# Altium project 10W_Class_D_Amp.PrjPcb
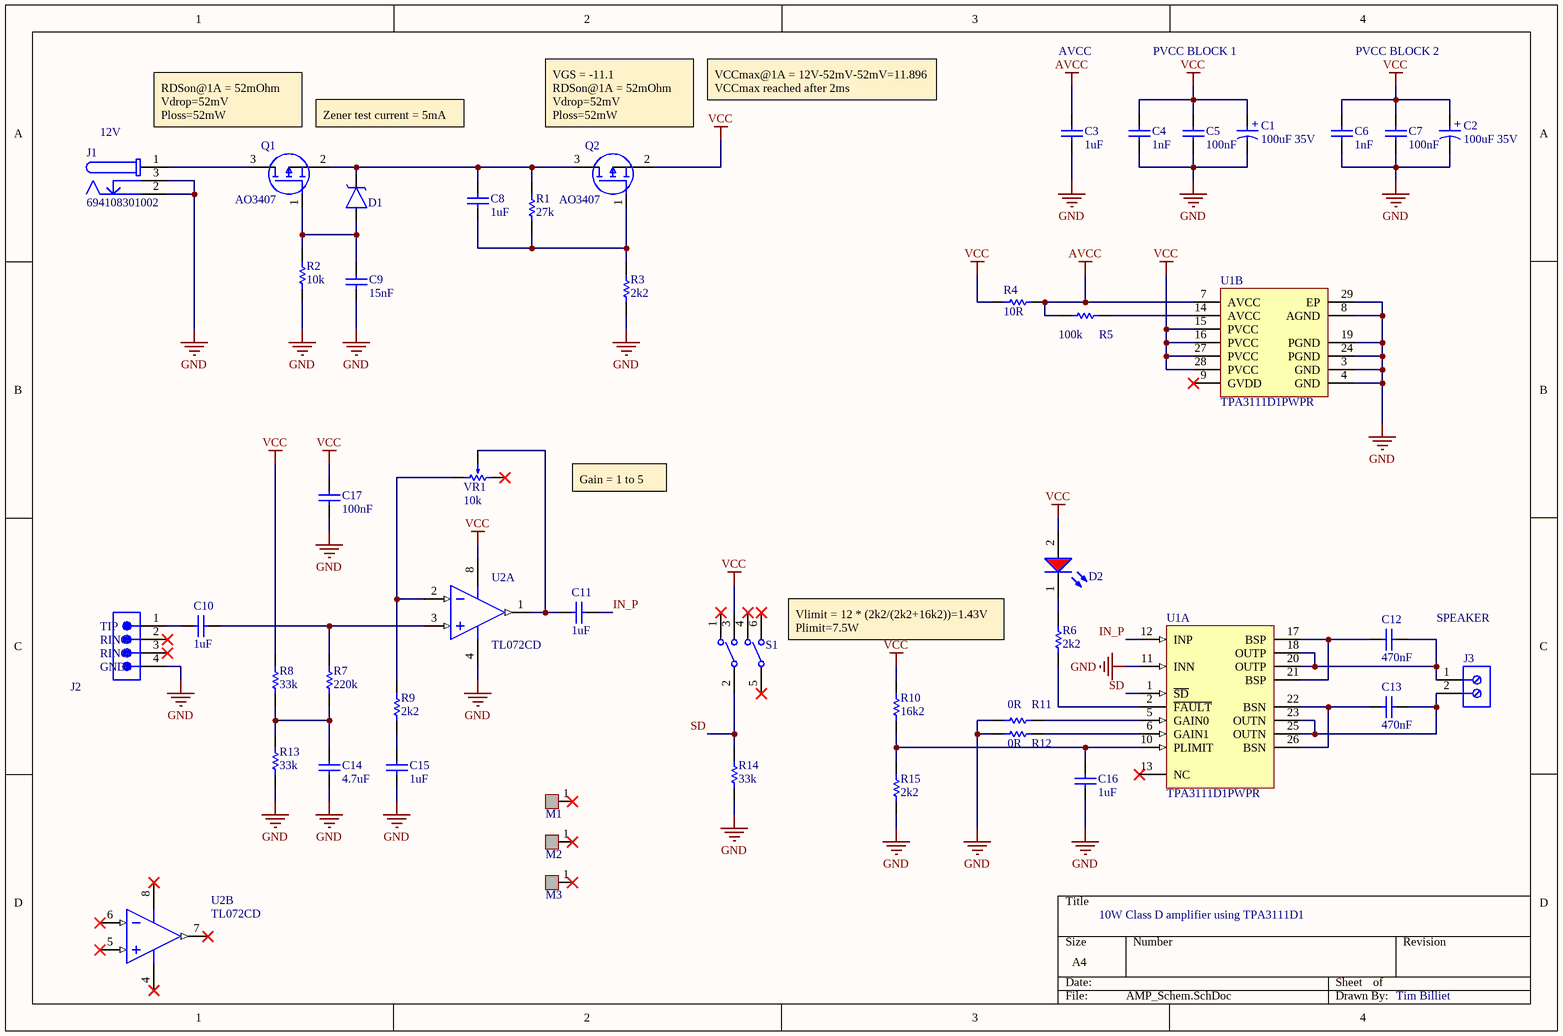
[diagram p0: AMP_Schem.SchDoc]
1 sheet, 46 parts. Net scope: global (net labels, ports and power ports of the same name join across sheets).
Board file: AMP_PCB.PcbDoc

## Sheet AMP_Schem.SchDoc
size A4; SheetNumber: 1; SheetTotal: 1; SPICEModelCacheFDDZXNEK: <root> / <DocumentId>FDDZXNEK</DocumentId> / <CacheFrame Number="0"> / <Model Name="tologic_0" Kind="CKT"> / <Text>.SUBCKT TOLOGIC_0  VI VO / ESLICE VO 0 VALUE = {IF(V(VI)&gt;2,1,0)} / RSLICE VO 0 1G / .ENDS TOLOGIC_0</Text> / </Model> / <Model Name="prheo_0" Kind="CKT"> / <Text>.SUBCKT PRHEO_0  G0 G1 VP VN  PARAMS: R1 = 9K R2 = 6K R3 = 15K R4 = 30K / ES1  VS1  0  VALUE  =  { IF(V(G0) &gt; 0.5,IF(V(G1) &gt; 0.5,1,0),0) } / ES2  VS2  0  VALUE  =  { IF(V(G0) &lt; 0.5,IF(V(G1) &gt; 0.5,1,0),0) } / ES3  VS3  0  VALUE  =  { IF(V(G0) &gt; 0.5,IF(V(G1) &lt; 0.5,1,0),0) } / ES4  VS4  0  VALUE  =  { IF(V(G0) &lt; 0.5,IF(V(G1) &lt; 0.5,1,0),0) } / ERES  VP  2   VALUE  =  { I(VSEI)*(V(VS2)*R2 + V(VS3)*(R3+R2) + V(VS4)*(R4+R3+R2)) } / VSEI  2   3  DC 0V / RSEI  3  VN  {R1} / .ENDS PRHEO_0</Text> / </Model> / <Model Name="comp" Kind="CKT"> / <Text>.SUBCKT COMP VDD VP VN VO VSS / ECOMP  VO  0  VALUE = { LIMIT(V(VP,VN)*1E5,V(VDD),V(VSS)) } / .ENDS COMP</Text> / </Model> / <Model Name="bd_comp_0" Kind="CKT"> / <Text>.SUBCKT BD_COMP_0  VDD VIP VIN REF VOP VON VSS / XCP  VDD  VIP  REF  VOP  VSS  COMP / XCN  VDD  VIN  REF  VON  VSS  COMP / .ENDS BD_COMP_0</Text> / <Dependency>0\comp</Dependency> / </Model> / <Model Name="plimit_0" Kind="CKT"> / <Text>.SUBCKT PLIMIT_0  PVCC VPLIMIT VSUPP / ELIMIT  PVCC  VSUPP  VALUE = { IF(V(PVCC)&gt;4*V(VPLIMIT),V(PVCC) - 4*V(VPLIMIT),0) } / .ENDS PLIMIT_0</Text> / </Model> / <Model Name="std_opa_0" Kind="CKT"> / <Text>.SUBCKT STD_OPA_0  VDD VIP VIN VOP VON VSS / EIP  FP1  VCM  VIP  VIN  200E3 / EIN  VCM  FP2  VIP  VIN  200E3 / RP1  FP1  VIBP  5.0E+6 / CP1  VIBP 0  3.18E-10 / RP2  FP2  VIBN  5.0E+6 / CP2  VIBN 0 3.18E-10 / EVCM VCM 0 VALUE = {(V(VDD,0)+V(VSS,0))*0.5} / EBP  VOP  0  VALUE = {LIMIT(V(VIBP),V(VDD) - 0.1,V(VSS) + 0.1)} / EBN  VON  0  VALUE = {LIMIT(V(VIBN),V(VDD) - 0.1,V(VSS) + 0.1)} / .ENDS STD_OPA_0</Text> / </Model> / <Model Name="delay_line" Kind="CKT"> / <Text>.SUBCKT DELAY_LINE VI VO / E1 VIX 0 VI 0 1 / T1 VIX 0 VOX 0 Z0 = 75 TD = 25NS / RL VOX 0 75 / E2 VO 0 VOX 0 1 / .ENDS DELAY_LINE</Text> / </Model> / <Model Name="and" Kind="CKT"> / <Text>.SUBCKT AND VDD A B Y VSS / EA  VA  0  VALUE = {IF(V(A)&gt;V(VCM),1,0)} / EB  VB  0  VALUE = {IF(V(B)&gt;V(VCM),1,0)} / ECM  VCM  0  VALUE = {(V(VDD,0)+V(VSS,0))*0.5} / EY  Y  0  VALUE = {IF(V(VA)*V(VB)&gt;0.5,V(VDD),V(VSS))} / .ENDS AND</Text> / </Model> / <Model Name="not" Kind="CKT"> / <Text>.SUBCKT NOT VDD VI VO VSS / ESLICE VO 0  VALUE = {IF(V(VI)&gt;V(VCM),V(VSS),V(VDD))} / ECM  VCM  0  VALUE = {(V(VDD,0)+V(VSS,0))*0.5} / .ENDS NOT</Text> / </Model> / <Model Name="hdriver_0" Kind="CKT"> / <Text>.SUBCKT HDRIVER_0  VDD VIA VIB VSS VHA VLA VHB VLB / X0  VIA  VXA  DELAY_LINE / X1  VDD  VIA  VXA  VHA  VSS AND / X2  VDD  VIA  VNA  VSS  NOT / X3  VNA  VYA  DELAY_LINE / X4  VDD  VNA  VYA  VLA  VSS AND / X5  VIB  VXB  DELAY_LINE / X6  VDD  VIB  VXB  VHB  VSS AND / X7  VDD  VIB  VNB  VSS  NOT / X8  VNB  VYB  DELAY_LINE / X9  VDD  VNB  VYB  VLB  VSS AND / .ENDS HDRIVER_0</Text> / <Dependency>0\delay_line</Dependency> / <Dependency>0\and</Dependency> / <Dependency>0\not</Dependency> / </Model> / <Model Name="hbridge_0" Kind="CKT"> / <Text>.SUBCKT HBRIDGE_0  AVDD PVDD VHA VLA VHB VLB VOA VOB SDB SSS VSS / ESD  VSDBX  0  VALUE = {IF(V(SDB)&gt;1.3,1,0)} / ESS  VSSSX  0  VALUE = {IF(V(SSS)&gt;1.3,1,0)} / EBETA  VBETA  0  POLY(1) (AVDD,0) 0 100 / *                            VDS       VG      VBETA     SHUTDOWN   SPECIAL / GAH  PVDD  VOA  VALUE = { V(PVDD,VOA)*V(VHA,0)*V(VBETA,0)*V(VSDBX,0)*V(VSSSX,0) } / RAH  PVDD  VOA  2E3 / DAH  VOA  PVDD  IDEAL_DIODE / GAL  VOA  VSS  VALUE = { V(VOA,VSS)*(V(VLA,0)*V(VSSSX,0) + V(AVDD,0)*(1 - V(VSSSX,0)))*V(VBETA,0)*V(VSDBX,0) } / RAL  VOA  VSS  2E3 / DAL  VSS  VOA  IDEAL_DIODE / GBH  PVDD  VOB  VALUE = { V(PVDD,VOB)*V(VHB,0)*V(VBETA,0)*V(VSDBX,0)*V(VSSSX,0) } / RBH  PVDD  VOB  2E3 / DBH  VOB  PVDD  IDEAL_DIODE / GBL  VOB  VSS  VALUE = { V(VOB,VSS)*(V(VLB,0)*V(VSSSX,0) + V(AVDD,0)*(1 - V(VSSSX,0)))*V(VBETA,0)*V(VSDBX,0) } / RBL  VOB  VSS  2E3 / DBL  VSS  VOB  IDEAL_DIODE / .MODEL IDEAL_DIODE D ( N = 0.01 ) / .ENDS HBRIDGE_0</Text> / </Model> / <Model Name="tpa3110d2_half_0" Kind="CKT"> / <Text>.SUBCKT TPA3110D2_HALF_0 GAIN0 INN INP AGND VREF GAIN1 AVCC PGND OUTN SD PLIMIT / + PVCC OUTP / XU4         G0 G1 INN 24 PRHEO_0 / XU6         G0 G1 INP 35 PRHEO_0 / XU3         PVCC PLIMIT PLIM PLIMIT_0 / C10         25 26 5P / C9          27 28 5P / C8          26 29 25P / C5          28 30 25P / XU11        AVCC 28 26 29 30 AGND STD_OPA_0 / R2          25 26 110K / R1          27 28 110K / XU10        AVCC PLIM 31 32 34 33 OUTP OUTN SD AVCC PGND HBRIDGE_0 / XU12        AVCC 36 37 AGND 31 32 34 33 HDRIVER_0 / R4          35 OUTN 600K / R3          24 OUTP 600K / C7          24 27 8.84P / C6          35 25 8.84P / XU1         AVCC 35 24 27 25 AGND STD_OPA_0 / XU8         AVCC 29 30 VREF 36 37 AGND BD_COMP_0 / XU5         GAIN0 G0 TOLOGIC_0 / XU2         GAIN1 G1 TOLOGIC_0 / .ENDS</Text> / <Dependency>0\tologic_0</Dependency> / <Dependency>0\prheo_0</Dependency> / <Dependency>0\bd_comp_0</Dependency> / <Dependency>0\plimit_0</Dependency> / <Dependency>0\std_opa_0</Dependency> / <Dependency>0\hdriver_0</Dependency> / <Dependency>0\hbridge_0</Dependency> / </Model> / <Model Name="sclamp_0" Kind="CKT"> / <Text>.SUBCKT SCLAMP_0   VIN VLIM VOUT / ES1  VIN  VOUT  VALUE = { IF(V(VIN,0)&gt;V(VLIM,0),V(VIN) - V(VLIM),0) } / .ENDS SCLAMP_0</Text> / </Model> / <Model Name="tri_gen_0" Kind="CKT"> / <Text>.SUBCKT TRI_GEN_0  VDD VSS VOTR PARAMS: DIV = 6 / VTR 1 0 PULSE (-1 1 0 1.6129US 1.6129US 0 3.2258US) / EADJUST VOTR VCM VALUE = {V(1,0)*V(VDD,0)/DIV} / EVCM VCM 0 VALUE = {(V(VDD,0)+V(VSS,0))*0.5} / .ENDS TRI_GEN_0</Text> / </Model> / <Model Name="tpa3111d1" Kind="CKT"> / <Text>.SUBCKT TPA3111D1 GAIN0 GAIN1 SD INN INP OUTP OUTN PVCC PLIMIT GND / V3          19 GND 6 / V1          20 GND 26 / XU1 GAIN0 INN INP GND VREF GAIN1 AVCC 17 OUTN SD PLIMIT 18 OUTP TPA3110D2_HALF_0 / R2          17 GND 200M / R1          PVCC_16 18 200M / XU6         PVCC_16 19 AVCC SCLAMP_0 / XU2         PLIMIT 20 PVCC_16 SCLAMP_0 / XU7         AVCC GND VREF TRI_GEN_0 / .ENDS</Text> / <Dependency>0\tpa3110d2_half_0</Dependency> / <Dependency>0\sclamp_0</Dependency> / <Dependency>0\tri_gen_0</Dependency> / </Model> / </CacheFrame> / </root>

### Parts
C1  value 100uF 35V  [Wurth D6.3x7.7mm]  (hidden comment: ROQANG RVT1V101M0607)
C2  value 100uF 35V  [Wurth D6.3x7.7mm]  (hidden comment: ROQANG RVT1V101M0607)
C3  value 1uF  [Wurth 0603 capacitor]  (hidden comment: Capacitor 1uF 0603)
C4  value 1nF  [Wurth 0603 capacitor]  (hidden comment: Capacitor 1nF 0603)
C5  value 100nF  [Wurth 0603 capacitor]  (hidden comment: Capacitor 100nF 0603 50V)
C6  value 1nF  [Wurth 0603 capacitor]  (hidden comment: Capacitor 1nF 0603)
C7  value 100nF  [Wurth 0603 capacitor]  (hidden comment: Capacitor 100nF 0603 50V)
C8  value 1uF  [Wurth 0603 capacitor]  (hidden comment: Capacitor 1uF 0603)
C9  value 15nF  [Wurth 0603 capacitor]  (hidden comment: Capacitor 15nF 0603)
C10  value 1uF  [Wurth 0603 capacitor]  (hidden comment: Capacitor 1uF 0603)
C11  value 1uF  [Wurth 0603 capacitor]  (hidden comment: Capacitor 1uF 0603)
C12  value 470nF  [Wurth 0603 capacitor]  (hidden comment: Capacitor 470nF 0603 50V)
C13  value 470nF  [Wurth 0603 capacitor]  (hidden comment: Capacitor 470nF 0603 50V)
C14  value 4.7uF  [Wurth 0603 capacitor]  (hidden comment: Capacitor 4.7uF 0603)
C15  value 1uF  [Wurth 0603 capacitor]  (hidden comment: Capacitor 1uF 0603)
C16  value 1uF  [Wurth 0603 capacitor]  (hidden comment: Capacitor 1uF 0603)
C17  value 100nF  [Wurth 0603 capacitor]  (hidden comment: Capacitor 100nF 0603 50V)
D1  BZT52B15V  [SOD-123]  (value not drawn)
D2  Red, 2V, 140°  [Wurth 0603 LED]  (value not drawn)
J1  694108301002  [694108301002]
J2  SHOU HAN PJ-320D  [SHOU HAN PJ-320D]  (value not drawn)
J3  691236510002  [691236510002]  (value not drawn)
M1  Mounting hole  [M3 hole]  (value not drawn)
M2  Mounting hole  [M3 hole]  (value not drawn)
M3  Mounting hole  [M3 hole]  (value not drawn)
Q1  AO3407  [UMW SOT23-3]
Q2  AO3407  [UMW SOT23-3]
R1  value 27k  [Wurth 0603 Resistor]  (hidden comment: Resistor 27k 0603)
R2  value 10k  [Wurth 0603 Resistor]  (hidden comment: Resistor 10k 0603)
R3  value 2k2  [Wurth 0603 Resistor]  (hidden comment: Resistor 2k2 0603)
R4  value 10R  [Wurth 0603 Resistor]  (hidden comment: Resistor 10R 0603)
R5  value 100k  [Wurth 0603 Resistor]  (hidden comment: Resistor 100k 0603)
R6  value 2k2  [Wurth 0603 Resistor]  (hidden comment: Resistor 2k2 0603)
R7  value 220k  [Wurth 0603 Resistor]  (hidden comment: Resistor 220k 0603)
R8  value 33k  [Wurth 0603 Resistor]  (hidden comment: Resistor 33k 0603)
R9  value 2k2  [Wurth 0603 Resistor]  (hidden comment: Resistor 2k2 0603)
R10  value 16k2  [Wurth 0603 Resistor]  (hidden comment: Resistor 16k2 0603)
R11  value 0R  [Wurth 0603 Resistor]  (hidden comment: Resistor 0R 0603)
R12  value 0R  [Wurth 0603 Resistor]  (hidden comment: Resistor 0R 0603)
R13  value 33k  [Wurth 0603 Resistor]  (hidden comment: Resistor 33k 0603)
R14  value 33k  [Wurth 0603 Resistor]  (hidden comment: Resistor 33k 0603)
R15  value 2k2  [Wurth 0603 Resistor]  (hidden comment: Resistor 2k2 0603)
S1  MST22D18G2 125  [SHOU HAN MST22D18G2 125 switch]  (value not drawn)
U1  TPA3111D1PWPR  [TI-PWP28-5720X1950TP_N]  (parts A,B of 2)
U2  TL072CD  [D0008A_M]  (parts A,B of 2)
VR1  value 10k  [ALPSALPINE RK09K11300DR]  (hidden comment: ALPSALPINE RK09K11300DR)

### Nets
AVCC: C3.2 R4.2 R5.1 U1.7(AVCC)
GND: C1.2(N) C2.2(N) C3.1 C4.1 C5.1 C6.1 C7.1 C9.1 C14.1 C15.2 C16.1 C17.1 J1.2 J1.3 J2.4 R2.1 R3.1 R11.1 R12.1 R13.1 R14.1 R15.1 U1.3(GND) U1.4(GND) U1.8(AGND) U1.11(INN) U1.19(PGND) U1.24(PGND) U1.29(EP) U2.4(VCC-)
VCC: C1.1(P) C2.1(P) C4.2 C5.2 C6.2 C7.2 C17.2 D2.2(A) Q2.2(S) R4.1 R8.2 R10.2 S1.3 U1.15(PVCC) U1.16(PVCC) U1.27(PVCC) U1.28(PVCC) U2.8(VCC+)
IN_P: C11.1 U1.12(INP)
SD: R14.2 S1.2 U1.1(~{SD})
NetC8_1: C8.1 Q2.1(G) R1.1 R3.2
NetC8_2: C8.2 D1.1(K) Q1.2(S) Q2.3(D) R1.2
NetC9_2: C9.2 D1.2(A) Q1.1(G) R2.2
NetC10_1: C10.1 R7.2 U2.3(IN1+)
NetC10_2: C10.2 J2.1
NetC11_2: C11.2 U2.1(OUT1) VR1.2
NetC12_1: C12.1 U1.17(BSP) U1.21(BSP)
NetC12_2: C12.2 J3.1 U1.18(OUTP) U1.20(OUTP)
NetC13_1: C13.1 U1.22(BSN) U1.26(BSN)
NetC13_2: C13.2 J3.2 U1.23(OUTN) U1.25(OUTN)
NetC14_2: C14.2 R7.1 R8.1 R13.2
NetC15_1: C15.1 R9.1
NetC16_2: C16.2 R10.1 R15.2 U1.10(PLIMIT)
NetD2_1: D2.1(K) R6.2
NetJ1_1: J1.1 Q1.3(D)
NetR5_2: R5.2 U1.14(AVCC)
NetR6_1: R6.1 U1.2(~{FAULT})
NetR9_2: R9.2 U2.2(IN1-) VR1.1
NetR11_2: R11.2 U1.5(GAIN0)
NetR12_2: R12.2 U1.6(GAIN1)

Not connected (* = marked no-connect by the designer): J2 2* 3*; M1 1*; M2 1*; M3 1*; S1 1* 4* 5* 6*; U1 9(GVDD)* 13(NC)*; U2 5(IN2+)* 6(IN2-)* 7(OUT2)*; VR1 3*

### Notes on the sheet
- VCCmax@1A = 12V-52mV-52mV=11.896
  VCCmax reached after 2ms
- AVCC
- PVCC BLOCK 1
- PVCC BLOCK 2
- (near J1) 12V
- RDSon@1A = 52mOhm
  Vdrop=52mV
  Ploss=52mW
- Zener test current = 5mA
- (near Q2) VGS = -11.1
  RDSon@1A = 52mOhm
  Vdrop=52mV
  Ploss=52mW
- Gain = 1 to 5
- (near S1) Vlimit = 12 * (2k2/(2k2+16k2))=1.43V
  Plimit=7.5W
- SPEAKER
- 10W Class D amplifier using TPA3111D1
- Tim Billiet
- (in symbol 3.5mm headphone jack smd) TIP; RING; GND
- (in symbol 100uF 35V SMD) +

### Library data of the parts
C1 C2 = 100uF 35V SMD: SMD,D6.3xL7.7mm
D1 = YONGYUTAI BZT52B15
D2 = LED RED 0603: WL-SMCD Mono-color Chip LED Diffused, SMT, size 0603, Red, 2V, 140°; Manufacturer Part Number: 150060RS55040; Manufacturer: Wurth Elektronik; Case/Size Code: 0603; Chip Technology: AlInGaP; Dominant Wavelength: 624nm; Luminous Intensity: 90mcd; Peak Wavelength: 632nm; Category: Signal LEDs; Match Code: WL-SMCD; ComponentLink1Description: Website Link; ComponentLink1URL: https://www.we-online.com/redexpert/article/150060RS55040?ad; ComponentLink2Description: Datasheet Link; ComponentLink2URL: https://www.we-online.com/redexpert/spec/150060RS55040?ad; Mount: Surface Mount; Operating Temperature Max: 85°C; Operating Temperature Min: -40°C; Packaging: Tape and Reel; Length: 1.6mm; Width: 0.8mm; Height: 0.4mm; Emitting Color: Red; Forward Voltage: 2V; Viewing Angle: 140°
J1 = CMP-1502-00190-4: DC Power Jack Connector WR-DC, Male, Right Angled, THT, 5 A, 24 V; Operating Supply Voltage: 24V; Shielding: Unshielded; Voltage Rating: 30V; Number of Contacts: 3; Insulation Resistance: 100MΩ; Current Rating: 5A; Min Operating Temperature: -40°C; Packaging: Bulk; Connector Type: Power; Housing Material: Polyamide; REACH SVHC: Unknown; Termination: Through Hole; Contact Gender: Female; Mount: Through Hole; RoHS: Compliant; Flammability Rating: UL94 V-0; Height: 11mm; Max Operating Temperature: 85°C; Contact Plating: Tin; Color: Black; Gender: Male; Contact Material: Gold, Tin
J2 = 3.5mm headphone jack smd
J3 = CMP-1502-02613-3: Terminal Block, Wtb, 2Way, 30-12Awg Rohs Compliant: Yes; Voltage Rating: 300V; Current Rating: 20A; Number of Contacts: 2; Number of Rows: 1; Packaging: Box; Max Operating Temperature: 120°C; RoHS: Compliant; Min Operating Temperature: -30°C; Number of Pins: 2; Lead Pitch: 5.08mm; Height: 18.1mm
Q1 Q2 = UMW AO3407A: MOSFET (P-Channel); Manufacturer_Name: Alpha & Omega Semiconductors; Datasheet Link: http://www.aosmd.com/pdfs/datasheet/ao3407a.pdf; Height: 1.25mm; Manufacturer_Part_Number: AO3407A; Arrow Part Number: AO3407A; Arrow Price/Stock: https://www.arrow.com/en/products/ao3407a/alpha-and-omega-semiconductor?region=nac
S1 = SHOU HAN MST22D18G2 125
U1 = CMP-0994-00250-2: None; Load Impedance: 8R; Number of Channels: 1; Output Power: 10W; Supply Current: 40mA; Max Supply Voltage: 26V; Voltage Gain: 36dB; Power Dissipation: 4.98W; Min Supply Voltage: 8V; Gain: 37dB; REACH SVHC: No SVHC; Case/Package: HTSSOP; Packaging: Tape and Reel; Radiation Hardening: No; Min Operating Temperature: -40°C; Max Output Power: 10W; Series: SpeakerGuard™; Package Quantity: 2000; Number of Pins: 28; RoHS Compliant: Yes; Lead Free: Lead Free; Nominal Supply Current: 40mA; Max Operating Temperature: 85°C
U2 = CMP-0017-00467-2: Dual Low-Noise JFET-Input General-Purpose Operational Amplifier, 7 to 36 V, 0 to 70 degC, 8-pin SOIC (D8), Green (RoHS & no Sb/Br); Manufacturer: Texas Instruments; Slew Rate(Typ)(V/us): 13; Total Supply Voltage(Max)(+5V is 5, +/-5V is 10): 36; Rating: Catalog; Sub Family: General Purpose Amplifier, High Supply Voltage Amplifier (>=30V); Total Supply Voltage(Min)(+5V is 5, +/-5V is 10): 7; Vn at 1kHz(Typ)(nV/rtHz): 18; IIB(Max)(pA): 200; Vio (25C)(Max)(mV): 10; Number of Channels: 2; Iq per channel(Max)(mA): 2.5; CMRR(Min)(dB): 70; GBW(Typ)(MHz): 3; ComponentLink3Description: Package Specification; DatasheetVersion: SLOS080J; Eco-Plan: Green (RoHS & no Sb/Br); PartNumber: TL072CD; Offset Drift(Typ)(uV/C): 18; ComponentLink2URL: http://www.ti.com/lit/ds/symlink/tl072.pdf; ComponentLink2Description: Datasheet; ComponentLink1URL: http://www.ti.com/; PackageDescription: 8-Pin Plastic Small Outline, Body 4.9 x 3.9 mm, Pitch 1.27 mm; Mounting Technology: Surface Mount; Code_JEDEC: MS-012; PackageVersion: 4040047-3/M, 06/2011; PackageReference: D0008A; ComponentLink3URL: http://www.ti.com/litv/pdf/msoi002j; ComponentLink1Description: Manufacturer URL
VR1 = Potentiometer 10k